# Altium schematic sheet Buck_Regulator_Evaluation.SchDoc: Regulator
size B; Date: 6/21/2022; Author: Andrew Lin; Chinyere McLean; Organization: ORGANIZATION; Address1: ADDRESS 1; Address2: ADDRESS 2; Address3: ADDRESS 3; Address4: ADDRESS 4; Revision: -; SheetNumber: 1; SheetTotal: 1; ENG_APP_DATE: --/--/--; DSN_APP_DATE: --/--/--; CHK_APP_DATE: --/--/--
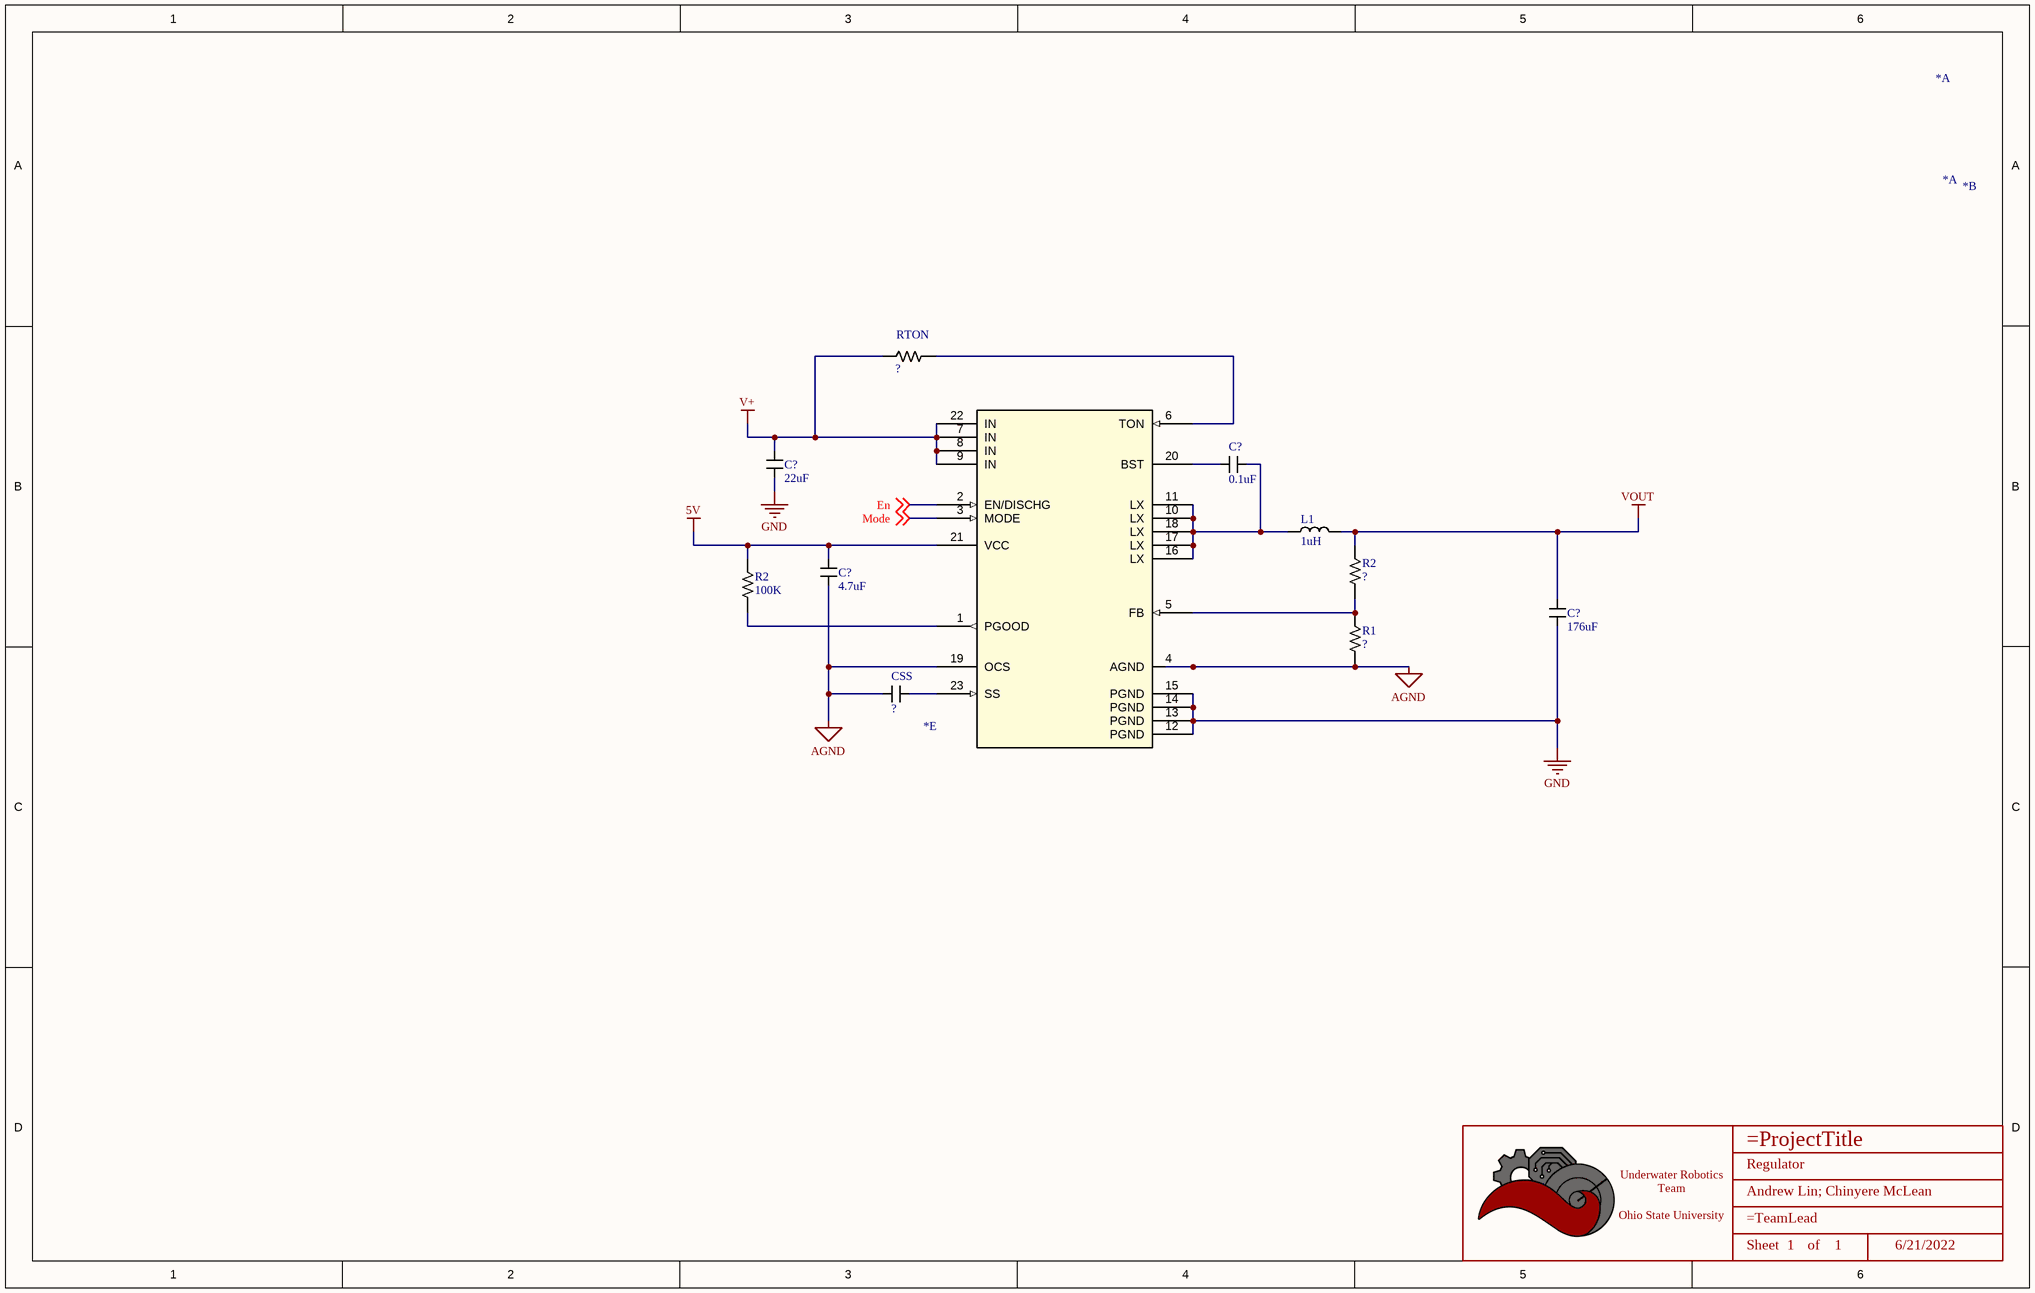
[diagram p0: Buck_Regulator_Evaluation.SchDoc]

## Parts
(Parts that share a designator on the sheet are numbered #1, #2 ... from top to bottom, then left to right.)
*#1  AOZ2264QI-15  [QFN4X4B_23L_EP2_S_AOS]  (value not drawn)  (part A of 6)
*#2  AOZ2264QI-15  [QFN4X4B_23L_EP2_S_AOS]  (value not drawn)  (part A of 6)
*#3  AOZ2264QI-15  [QFN4X4B_23L_EP2_S_AOS]  (value not drawn)  (part B of 6)
*#4  AOZ2264QI-15  [QFN4X4B_23L_EP2_S_AOS]  (value not drawn)  (part E of 6)
*#5  Title_Block  [LOGO]  (value not drawn)  (graphical)
C?#1  value 22uF  [CAPACITOR_0603]  (hidden comment: 22uF Ceramic)
C?#2  value 0.1uF  [CAPACITOR_0603]  (hidden comment: 100nF Ceramic 6.3V)
C?#3  value 4.7uF  [CAPACITOR_0603]  (hidden comment: 47uF Ceramic 6.3V)
C?#4  Value (uF): 176uF  [CAPACITOR_0603]  (hidden comment: 10uF Ceramic 6.3V)
CSS  47uF Ceramic 6.3V  [CAPACITOR_0603]  (value not drawn)
L1  value 1uH  [INDUCTOR_VLC5020T]  (hidden comment: 15uH Shielded)
R1  1k Ohm 5% 1/8W  [RESISTOR_0603]  (value not drawn)
R2#1  1k Ohm 5% 1/8W  [RESISTOR_0603]  (value not drawn)
R2#2  Value  (Ohms): 100K  [RESISTOR_0603]  (hidden comment: 100k Ohm 5% 1/8W)
RTON  1k Ohm 5% 1/8W  [RESISTOR_0603]  (value not drawn)

## Nets
5V: *#4.21(VCC) C?#3.1 R2#2.2
AGND: *#4.4(AGND) *#4.19(OCS) C?#3.2 CSS.2 R1.1
GND: *#4.12(PGND) *#4.13(PGND) *#4.14(PGND) *#4.15(PGND) C?#1.2 C?#4.2
V+: *#4.7(IN) *#4.8(IN) *#4.9(IN) *#4.22(IN) C?#1.1 RTON.2
VOUT: C?#4.1 L1.1 R2#1.2
En: *#4.2(EN/DISCHG) ; off-sheet En
Mode: *#4.3(MODE) ; off-sheet Mode
Net*#4_1: *#4.1(PGOOD) R2#2.1
Net*#4_5: *#4.5(FB) R1.2 R2#1.1
Net*#4_6: *#4.6(TON) RTON.1
Net*#4_10: *#4.10(LX) *#4.11(LX) *#4.16(LX) *#4.17(LX) *#4.18(LX) C?#2.1 L1.2
Net*#4_20: *#4.20(BST) C?#2.2
Net*#4_23: *#4.23(SS) CSS.1

## Notes on the sheet
- DWG. NO.
- REV.
- SHT.
- THIS DOCUMENT AND THE DATA DISCLOSED HEREIN OR HEREWITH IS THE PROPERTY OF ALTIUM LIMITED AND MAY BE FREELY DISTRIBUTED IN WHOLE. NO RIGHTS ARE RESERVED OR EXPRESS OR IMPLIED WARANTEE GIVEN.
- REVISION
- DESCRIPTION
- DATE
- APPROVED
- ENG:
- APPROVALS
- PROJECT
- DSN:
- CHK:
- REFERENCE DOCUMENTS
- PROJECT REVISION:
- TITLE
- DOCUMENT REVISION:
- DESIGN ITEM:
- BOM:
- FAB DWG:
- PCB DWG:
- ASSY DWG:
- SCALE:
- SIZE
- B
- CAGE CODE
- FILE NAME
- DWG NO.
- SHEET
- OF
- REV
- (in symbol Title_Block) Underwater Robotics Team / Ohio State University; Sheet; of

## Library data of the parts
*#1-*#4 = AOZ2264QI-15: 15A COT EZBuck Regulator (Auto Restart), QFN4x4B-23L, RoHS; Manufacturer: Alpha & Omega Semiconductor; Supplier 1: Digi-Key; Supplier Part Number 1: 785-1897-1-ND; Manufacturer Part Number: AOZ2264QI-15; RoHS: Yes; Category: Voltage Regulators - Switching; Stock 1: 26930; Pricing 1: 1=1.71000, 10=1.53700, 25=1.44960, 100=1.23500, 250=1.15964, 500=1.01468, 1000=0.84074 (USD); RoHS Compliant: Yes; ComponentLink1URL: http://www.aosmd.com/res/data_sheets/AOZ2264QI-10.pdf?src-supplier=Digi-Key; ComponentLink1Description: http://www.aosmd.com/res/data_sheets/AOZ2264QI-10.pdf?src-supplier=Digi-Key
*#5 = Title_Block: UWRT Schematic Title Block Template / Created June 2021, Dylan Trainor
C?#1 = CAPACITOR_22uF_0603: Cap 22uF 6.3V +/-20% / Ceramic 0603; Made By: Flip B; Tolerance: +/- 20%; Voltage: 6.3V; Supplier 1: Digi-Key; Supplier Part Number 1: 445-8028-1-ND
C?#2 = CAPACITOR_0.1uF_0603: Cap 100nF 6.3V +/-10% / Ceramic 0603; Made By: Flip B; ComponentLink1Description: Datsheet; ComponentLink1URL: https://www.mouser.com/datasheet/2/212/KEM_C1002_X7R_SMD-1102033.pdf; Tolerance: +/- 10%; Voltage: 6.3V; Supplier 1: Digi-Key; Supplier Part Number 1: 399-15351-1-ND
C?#3 CSS = CAPACITOR_47uF_0603: Cap 47uF 6.3V +/-20% / Ceramic 0603; Made By: Flip B; ComponentLink1Description: Datsheet; ComponentLink1URL: https://www.mouser.com/datasheet/2/212/KEM_C1002_X7R_SMD-1102033.pdf; Tolerance: +/- 20%; Voltage: 6.3V; Supplier 1: Digi-Key; Supplier Part Number 1: 490-13247-1-ND
  CSS: Value: ?
C?#4 = CAPACITOR_10uF_0603: Cap 10uF 6.3V +/-20% / Ceramic 0603; Made By: Flip B; ComponentLink1Description: Digikey; ComponentLink1URL: https://www.digikey.com/en/products/detail/samsung-electro-mechanics/CL10A106MQ8NNNC/3886777; Supplier 1: Digi-Key; Supplier Part Number 1: 1276-1119-1-ND; Tolerance: +/- 20%; Voltage: 6.3V
L1 = INDUCTOR_15uH_4020: Inductor Shielded 15uH 1.5A +/-20%; Made By: Flip B; DC Resistance: 374mOhm; Tolerance: +/- 20%; ComponentLink1Description: Datasheet; ComponentLink1URL: https://www.bourns.com/docs/Product-Datasheets/SRP4020TA.pdf; Current Rating: 1.5A; Supplier 1: Digi-Key; Supplier Part Number 1: SRP4020TA-150MCT-ND
R1 R2#1 RTON = RESISTOR_1K_0603: RES 1k OHM 5% 1/8W 0603; Tolerance: +/- 5%; Made By: Robert Pafford; ComponentLink1Description: Datasheet; ComponentLink1URL: https://www.bourns.com/docs/product-datasheets/CRxxxxx.pdf; Wattage: 1/8W; Supplier: Digikey; Digikey Part Numer: CR0603-JW-104ELFTR-ND; Supplier 1: Digi-Key; Supplier Part Number 1: 2019-RK73B1JTTD102JCT-ND; Value  (Ohms): ?
R2#2 = RESISTOR_100K_0603: RES 100k OHM 5% 1/10W 0603; Tolerance: +/- 5%; Made By: Flip B; ComponentLink1Description: Datasheet; ComponentLink1URL: https://www.bourns.com/docs/product-datasheets/CRxxxxx.pdf; Wattage: 1/10W; Supplier: Digikey; Digikey Part Numer: CR0603-JW-104ELFTR-ND; Supplier 1: Digi-Key; Supplier Part Number 1: CR0603-JW-104ELFCT-ND